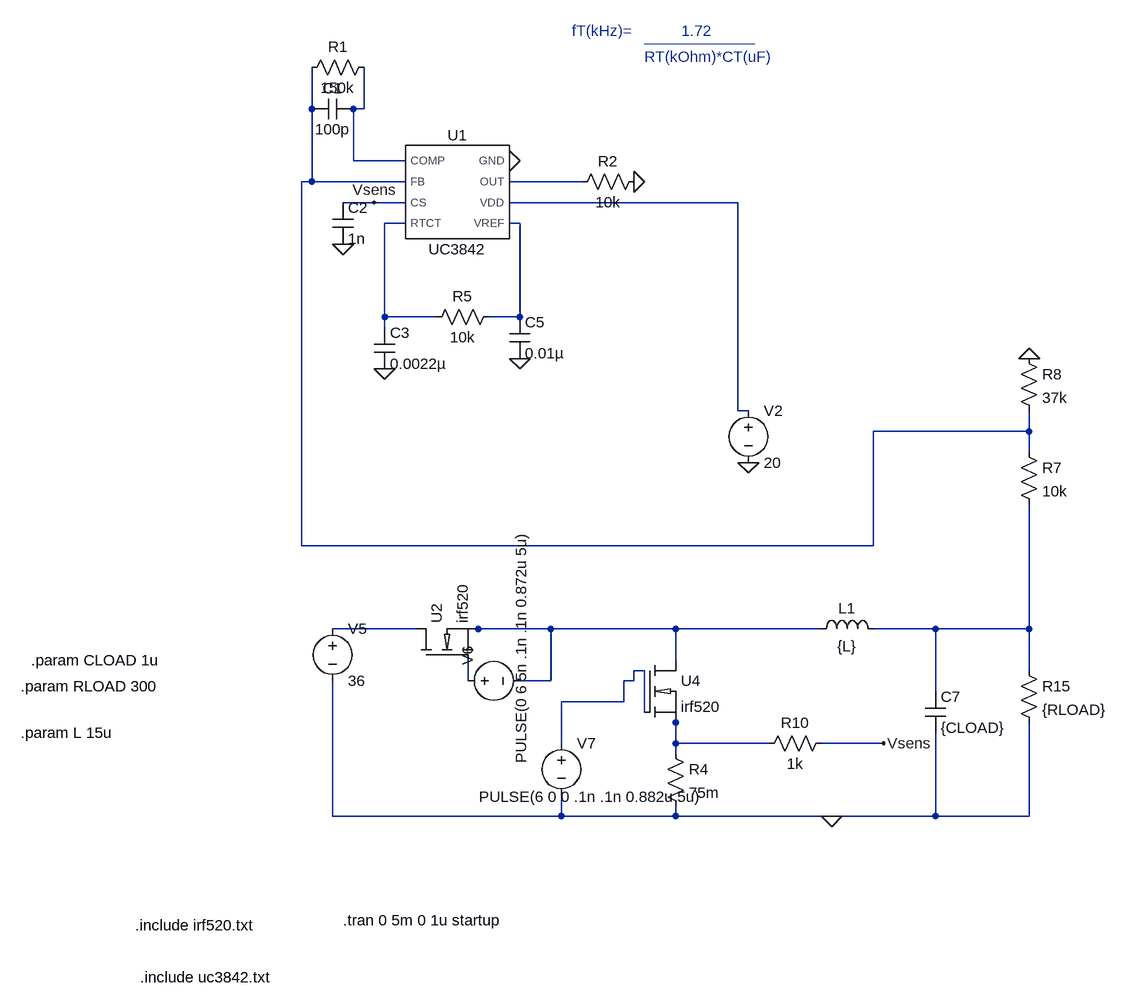
[diagram p0: schematic buck_controlador_uc3842.asc]
buck_controlador_uc3842.asc, the LTspice schematic file:
Version 4
SHEET 1 2408 680
WIRE 80 -1792 80 -1856
WIRE 160 -1792 160 -1856
WIRE 160 -1792 144 -1792
WIRE 144 -1712 144 -1792
WIRE 224 -1712 144 -1712
WIRE 80 -1680 80 -1792
WIRE 80 -1680 64 -1680
WIRE 224 -1680 80 -1680
WIRE 496 -1680 384 -1680
WIRE 176 -1648 128 -1648
WIRE 224 -1648 176 -1648
WIRE 736 -1648 384 -1648
WIRE 224 -1616 192 -1616
WIRE 400 -1616 384 -1616
WIRE 192 -1472 192 -1616
WIRE 272 -1472 192 -1472
WIRE 400 -1472 400 -1616
WIRE 400 -1472 352 -1472
WIRE 192 -1456 192 -1472
WIRE 736 -1328 736 -1648
WIRE 752 -1328 736 -1328
WIRE 1184 -1296 1184 -1328
WIRE 1184 -1296 944 -1296
WIRE 1184 -1264 1184 -1296
WIRE 64 -1120 64 -1680
WIRE 944 -1120 944 -1296
WIRE 944 -1120 64 -1120
WIRE 240 -992 112 -992
WIRE 336 -992 304 -992
WIRE 448 -992 336 -992
WIRE 640 -992 448 -992
WIRE 864 -992 640 -992
WIRE 1040 -992 944 -992
WIRE 1184 -992 1184 -1184
WIRE 1184 -992 1040 -992
WIRE 640 -944 640 -992
WIRE 592 -928 576 -928
WIRE 1184 -928 1184 -992
WIRE 320 -912 320 -944
WIRE 448 -912 448 -992
WIRE 448 -912 400 -912
WIRE 576 -912 576 -928
WIRE 576 -912 560 -912
WIRE 1040 -896 1040 -992
WIRE 560 -880 560 -912
WIRE 560 -880 464 -880
WIRE 592 -864 592 -928
WIRE 640 -848 640 -864
WIRE 464 -816 464 -880
WIRE 640 -816 640 -848
WIRE 784 -816 640 -816
WIRE 960 -816 864 -816
WIRE 640 -800 640 -816
WIRE 112 -704 112 -912
WIRE 464 -704 464 -736
WIRE 464 -704 112 -704
WIRE 640 -704 640 -720
WIRE 640 -704 464 -704
WIRE 880 -704 640 -704
WIRE 1040 -704 1040 -832
WIRE 1040 -704 880 -704
WIRE 1184 -704 1184 -848
WIRE 1184 -704 1040 -704
FLAG 752 -1248 0
FLAG 576 -1680 0
FLAG 1184 -1408 0
FLAG 880 -704 0
FLAG 960 -816 Vsens
FLAG 384 -1712 0
FLAG 192 -1392 0
FLAG 128 -1584 0
FLAG 176 -1648 Vsens
FLAG 400 -1408 0
SYMBOL voltage 752 -1344 R0
WINDOW 123 0 0 Left 0
WINDOW 39 0 0 Left 0
SYMATTR InstName V2
SYMATTR Value 20
SYMBOL res 592 -1696 R90
WINDOW 0 0 56 VBottom 2
WINDOW 3 32 56 VTop 2
SYMATTR InstName R2
SYMATTR Value 10k
SYMBOL res 1168 -1280 R0
SYMATTR InstName R7
SYMATTR Value 10k
SYMBOL res 1168 -1424 R0
SYMATTR InstName R8
SYMATTR Value 37k
SYMBOL voltage 112 -1008 R0
WINDOW 123 0 0 Left 0
WINDOW 39 0 0 Left 0
SYMATTR InstName V5
SYMATTR Value 36
SYMBOL voltage 304 -912 R270
WINDOW 3 -127 98 Left 2
WINDOW 123 0 0 Left 0
WINDOW 39 0 0 Left 0
SYMATTR Value PULSE(0 6 5n .1n .1n 0.872u 5u)
SYMATTR InstName V6
SYMBOL ind 848 -976 R270
WINDOW 0 32 56 VTop 2
WINDOW 3 5 56 VBottom 2
SYMATTR InstName L1
SYMATTR Value {L}
SYMBOL cap 1024 -896 R0
SYMATTR InstName C7
SYMATTR Value {CLOAD}
SYMBOL res 1168 -944 R0
SYMATTR InstName R15
SYMATTR Value {RLOAD}
SYMBOL voltage 464 -832 R0
WINDOW 3 -127 98 Left 2
WINDOW 123 0 0 Left 0
WINDOW 39 0 0 Left 0
SYMATTR Value PULSE(6 0 0 .1n .1n 0.882u 5u)
SYMATTR InstName V7
SYMBOL irf520 240 -944 R270
SYMATTR InstName U2
SYMBOL irf520 592 -944 R0
SYMATTR InstName U4
SYMBOL res 624 -816 R0
SYMATTR InstName R4
SYMATTR Value 75m
SYMBOL res 880 -832 R90
WINDOW 0 0 56 VBottom 2
WINDOW 3 32 56 VTop 2
SYMATTR InstName R10
SYMATTR Value 1k
SYMBOL UC3842 304 -1664 R0
SYMATTR InstName U1
SYMBOL res 176 -1872 R90
WINDOW 0 0 56 VBottom 2
WINDOW 3 32 56 VTop 2
SYMATTR InstName R1
SYMATTR Value 150k
SYMBOL cap 176 -1456 R0
SYMATTR InstName C3
SYMATTR Value 0.0022µ
SYMBOL res 368 -1488 R90
WINDOW 0 0 56 VBottom 2
WINDOW 3 32 56 VTop 2
SYMATTR InstName R5
SYMATTR Value 10k
SYMBOL cap 112 -1648 R0
SYMATTR InstName C2
SYMATTR Value 1n
SYMBOL cap 384 -1472 R0
SYMATTR InstName C5
SYMATTR Value 0.01µ
SYMBOL cap 144 -1808 R90
WINDOW 0 0 32 VBottom 2
WINDOW 3 32 32 VTop 2
SYMATTR InstName C1
SYMATTR Value 100p
TEXT 128 -544 Left 2 !.tran 0 5m 0 1u startup
TEXT -192 -536 Left 2 !.include irf520.txt
TEXT -184 -456 Left 2 !.include uc3842.txt
TEXT 480 -1912 Left 2 ;fT(kHz)=           1.72
TEXT 592 -1904 Left 2 ;_____________
TEXT 592 -1872 Left 2 ;RT(kOhm)*CT(uF)
TEXT -352 -944 Left 2 !.param CLOAD 1u
TEXT -368 -904 Left 2 !.param RLOAD 300
TEXT -368 -832 Left 2 !.param L 15u

The netlist it stands for:
* buck_controlador_uc3842.asc
V2 N004 0 20
R2 0 N003 10k
R7 N001 N009 10k
R8 0 N001 37k
V5 N007 0 36
V6 N011 N008 PULSE(0 6 5n .1n .1n 0.872u 5u)
L1 N008 N009 {L}
C7 N009 0 {CLOAD}
R15 N009 0 {RLOAD}
V7 N010 0 PULSE(6 0 0 .1n .1n 0.882u 5u)
XU2 N007 N011 N008 irf520
XU4 N008 N010 N012 irf520
R4 N012 0 75m
R10 Vsens N012 1k
XU1 N002 N001 Vsens N005 0 N003 N004 N006 UC3842  ; pins COMP FB CS RTCT GND OUT VDD VREF
R1 N002 N001 150k
C3 N005 0 0.0022µ
R5 N006 N005 10k
C2 Vsens 0 1n
C5 N006 0 0.01µ
C1 N002 N001 100p
.tran 0 5m 0 1u startup
.include irf520.txt
.include uc3842.txt
* fT(kHz)=           1.72
* _____________
* RT(kOhm)*CT(uF)
.param CLOAD 1u
.param RLOAD 300
.param L 15u
.lib irf520.txt
.lib uc3842.txt
.backanno
.end